# Altium schematic sheet Power.SchDoc
size A
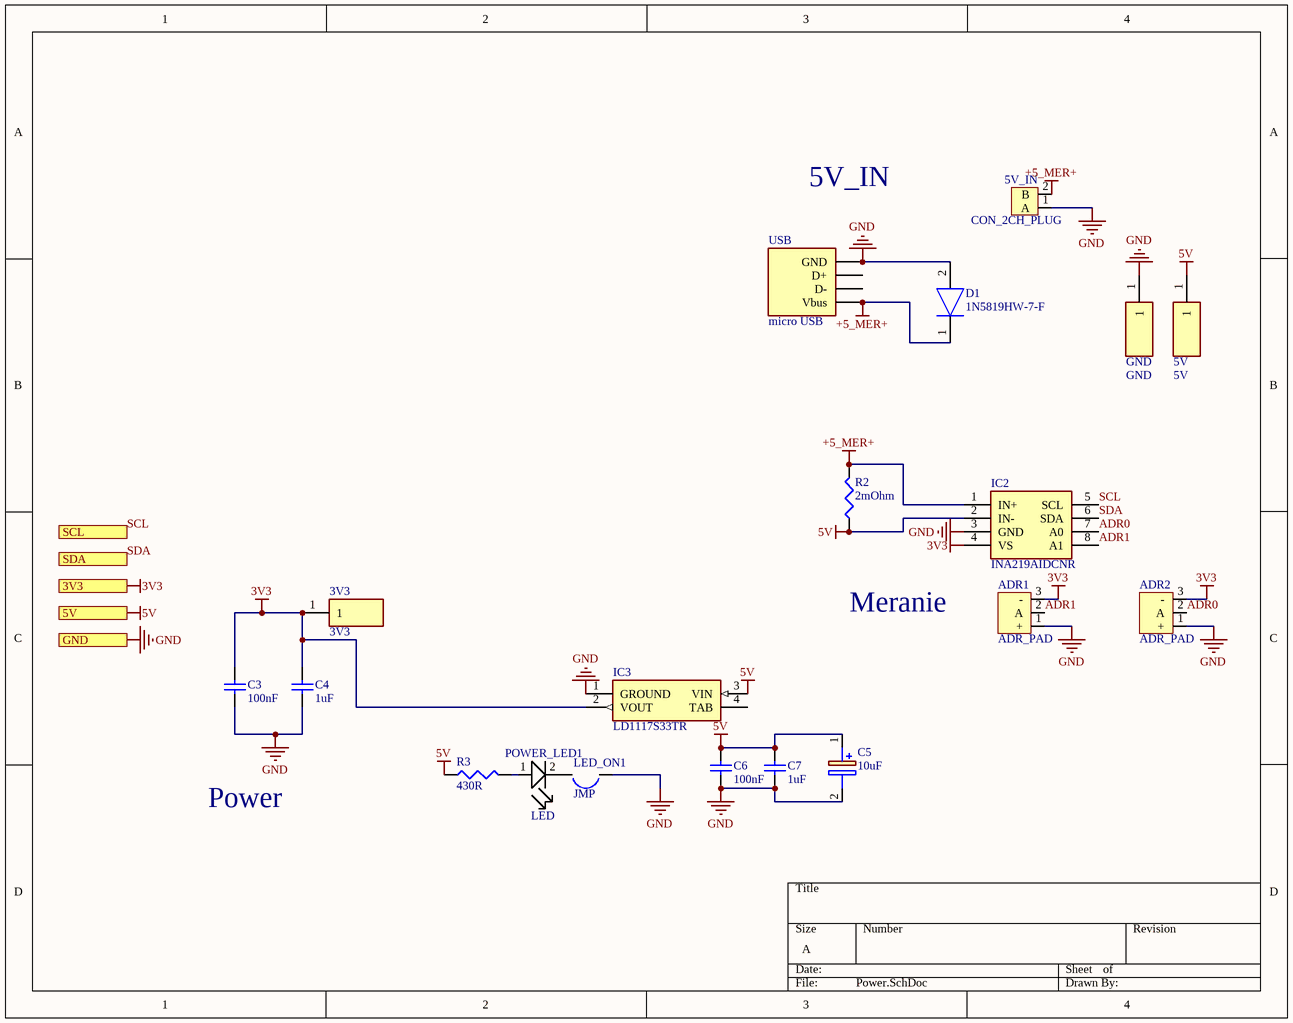
[diagram p0: Power.SchDoc]

## Parts
3V3  3V3  [1508000150000030]
5V  5V  [1508000150000030]
5V_IN  CON_2CH_PLUG  [CON_2CH_PLUG]
ADR1  ADR_PAD  [SOLDER_PAD]
ADR2  ADR_PAD  [SOLDER_PAD]
C3  100nF  [1608[0603]]
C4  1uF  [1608[0603]]
C5  10uF  [CAPPM3216X180N]
C6  100nF  [1608[0603]]
C7  1uF  [1608[0603]]
D1  1N5819HW-7-F  [SOD3716X145N]
GND  GND  [1508000150000030]
IC2  INA219AIDCNR  [SOT65P280X145-8N]
IC3  LD1117S33TR  [SOT230P700X180-4N]
LED_ON1  JMP  [JMP]
POWER_LED1  LED  [LED5mA]
R2  2mOhm  [RESC3216X75N]
R3  430R  [J1-0603]
USB  micro USB  [micro USB]

## Ports
3V3, 5V, GND, SCL, SDA

## Nets
3V3: 3V3.1 ADR1.3(-) ADR2.3(-) C3.1 C4.1 IC2.4(VS) IC3.2(VOUT) ; port 3V3
5V: 5V.1 C5.1(+) C6.1 C7.1 IC2.2(IN-) IC3.3(VIN) R2.1 R3.1 ; port 5V
+5_MER+: 5V_IN.2(B) D1.1(K) IC2.1(IN+) R2.2 USB.1(Vbus)
GND: 5V_IN.1(A) ADR1.1(+) ADR2.1(+) C3.2 C4.2 C5.2(-) C6.2 C7.2 D1.2(A) GND.1 IC2.3(GND) IC3.1(GROUND) LED_ON1.1 USB.5(GND) ; port GND
ADR0: ADR2.2(A) IC2.7(A0)
ADR1: ADR1.2(A) IC2.8(A1)
SCL: IC2.5(SCL) ; port SCL
SDA: IC2.6(SDA) ; port SDA
NetLED_ON1_2: LED_ON1.2 POWER_LED1.2
NetPOWER_LED1_1: POWER_LED1.1 R3.2

Not connected (* = marked no-connect by the designer): IC3 4(TAB); USB 2(D-) 3(D+)

## Notes on the sheet
- 5V_IN
- Meranie
- Power

## Library data of the parts
3V3 5V GND = 5015: Undefined or Miscellaneous; Manufacturer_Name: Keystone Electronics; Allied_Number: 70182998; Datasheet Link: http://www.keyelco.com/product-pdf.cfm?p=1353; Height: 1.52mm; Manufacturer_Part_Number: 5015; Mouser Part Number: 534-5015; Mouser Price/Stock: https://www.mouser.com/Search/Refine.aspx?Keyword=534-5015; Allied Price/Stock: https://www.alliedelec.com/keystone-electronics-5015/70182998/
5V_IN = CON_2CH_PLUG: TBG-5.0-KW-2P
ADR1 ADR2 = ADR_PAD: ADR PAD 3 PIN
C3 C4 C7 = Cap Semi: Capacitor; Published: 8-Jun-2000; LatestRevisionDate: 29-May-2009; LatestRevisionNote: IPC-7351 Footprint Added.; PackageReference: C1206; Publisher: Altium Limited; PackageDescription: Chip Capacitor
  C3: Value: 100nF
  C4 C7: Value: 1uF
C5 = TAJA106K004RNJ: Capacitor Polarised; Manufacturer_Name: AVX; Datasheet Link: http://www.farnell.com/datasheets/1680476.pdf; Height: 1.8mm; Manufacturer_Part_Number: TAJA106K004RNJ; Mouser Part Number: 581-TAJA106K004R; Mouser Price/Stock: https://www.mouser.com/Search/Refine.aspx?Keyword=581-TAJA106K004R
C6 = Cap Semi: Capacitor; Value: 100pF; Published: 8-Jun-2000; LatestRevisionDate: 29-May-2009; LatestRevisionNote: IPC-7351 Footprint Added.; PackageReference: C1206; Publisher: Altium Limited; PackageDescription: Chip Capacitor
D1 = 1N5819HW-7-F: Diode; Manufacturer_Name: Diodes Inc.; Datasheet Link: http://www.diodes.com/_files/datasheets/ds30217.pdf; Height: 1.45mm; Manufacturer_Part_Number: 1N5819HW-7-F; Arrow Part Number: 1N5819HW-7-F; Arrow Price/Stock: https://www.arrow.com/en/products/1n5819hw-7-f/diodes-incorporated; Mouser Part Number: 621-1N5819HW-F; Mouser Price/Stock: https://www.mouser.co.uk/ProductDetail/Diodes-Incorporated/1N5819HW-7-F?qs=NQ47qNm99eDyWTEd07miYA%3D%3D
IC2 = INA219BIDCNR: Integrated Circuit; Manufacturer_Name: Texas Instruments; Datasheet Link: http://www.ti.com/lit/ds/symlink/ina219.pdf; Height: 1.45mm; Manufacturer_Part_Number: INA219BIDCNR; Mouser Part Number: 595-INA219BIDCNR; Mouser Price/Stock: https://www.mouser.com/Search/Refine.aspx?Keyword=595-INA219BIDCNR
IC3 = LD1117S33TR: Integrated Circuit; Manufacturer_Name: STMicroelectronics; Allied_Number: 70390201; Datasheet Link: http://www.st.com/st-web-ui/static/active/en/resource/technical/document/datasheet/CD00000544.pdf; Height: 1.8mm; Manufacturer_Part_Number: LD1117S33TR; Mouser Part Number: 511-LD1117S33; Mouser Price/Stock: https://www.mouser.com/Search/Refine.aspx?Keyword=511-LD1117S33; RS Part Number: 7140697P; RS Price/Stock: http://uk.rs-online.com/web/p/products/7140697P; Allied Price/Stock: http://www.alliedelec.com/stmicroelectronics-ld1117s33tr/70390201/
R2 R3 = Res3: Resistor; Published: 8-Jun-2000; LatestRevisionDate: 29-May-2009; LatestRevisionNote: IPC-7351 Footprint Added.; PackageReference: J1-0603; Publisher: Altium Limited; PackageDescription: Chip Resistor
  R2: Value: 2mOhm
  R3: Value: 430R